# Altium schematic sheet TMS320F28335.SchDoc: TMS320F28335
size A4; Author: Anderson, Jorge Luis; CompanyName: LEICI - FI-UNLP; Revision: 1.3; SheetNumber: 2; SheetTotal: 5; Number: 1; ProjectName: Placa adaptadora TMS320F28835
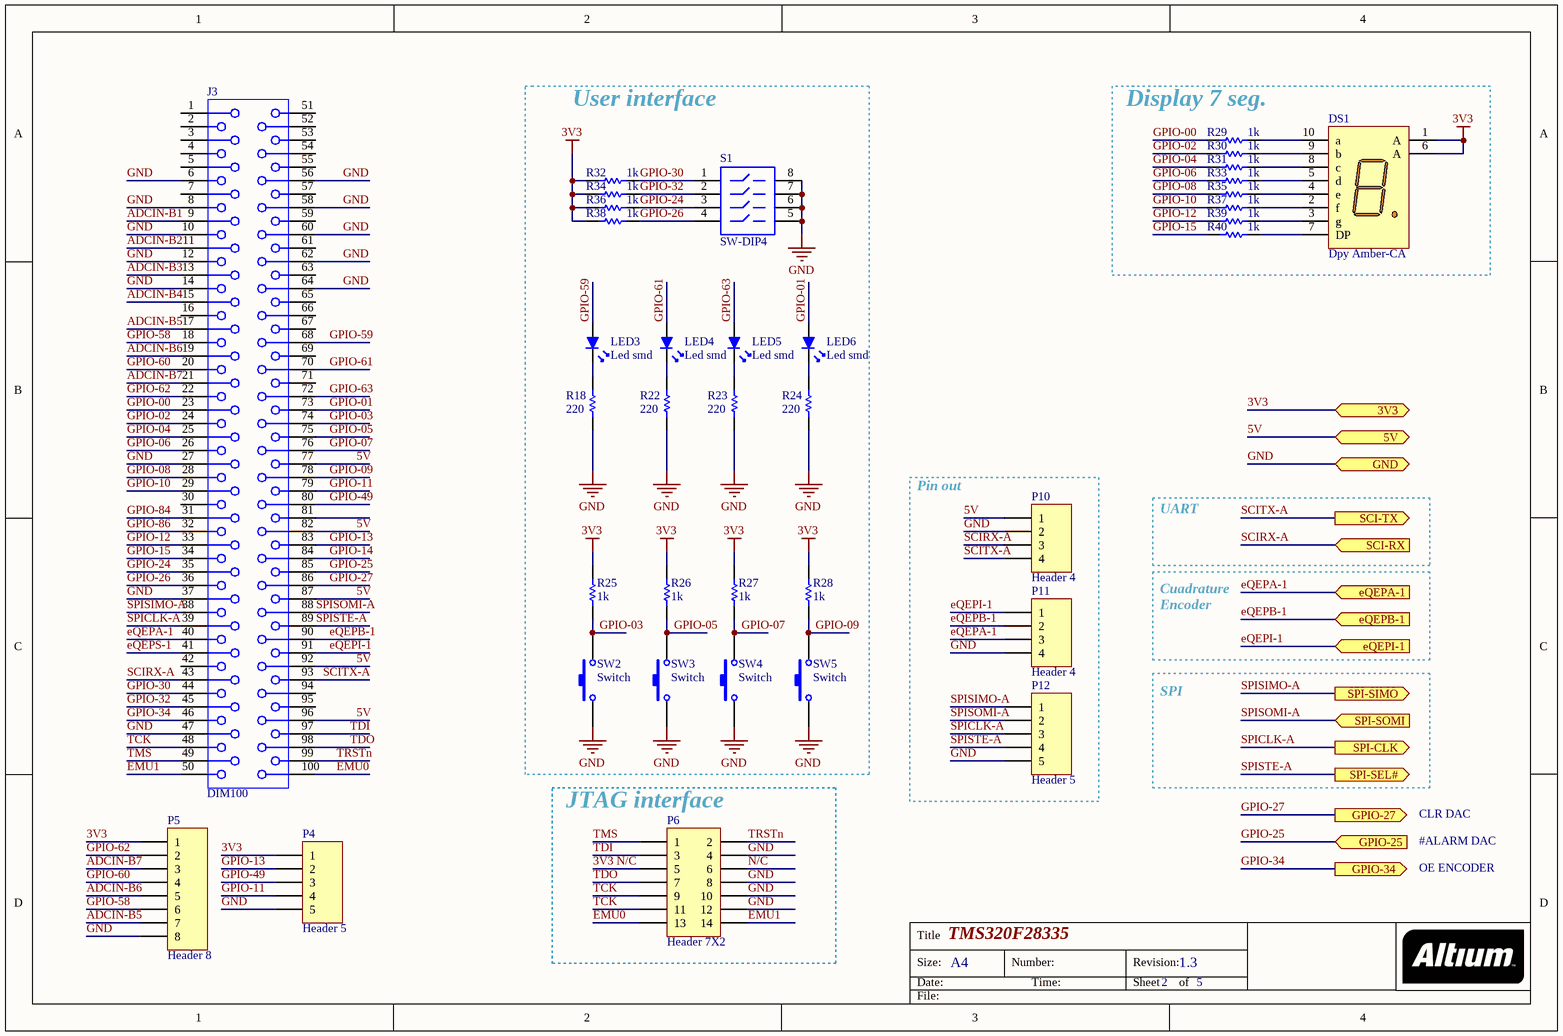
[diagram p0: TMS320F28335.SchDoc]

## Parts
DS1  Dpy Amber-CA  [A]
J3  DIM100  [390213-1]
LED3  Led smd  [LED 1206]
LED4  Led smd  [LED 1206]
LED5  Led smd  [LED 1206]
LED6  Led smd  [LED 1206]
P4  Header 5  [HDR1X5]
P5  Header 8  [HDR1X8]
P6  Header 7X2  [HDR2X7]
P10  Header 4  [HDR1X4]
P11  Header 4  [HDR1X4]
P12  Header 5  [HDR1X5]
R18  value 220  [R 1206]  (hidden comment: R220)
R22  value 220  [R 1206]  (hidden comment: R220)
R23  value 220  [R 1206]  (hidden comment: R220)
R24  value 220  [R 1206]  (hidden comment: R220)
R25  value 1k  [R 1206]  (hidden comment: R1k)
R26  value 1k  [R 1206]  (hidden comment: R1k)
R27  value 1k  [R 1206]  (hidden comment: R1k)
R28  value 1k  [R 1206]  (hidden comment: R1k)
R29  value 1k  [R 1206]  (hidden comment: R1k)
R30  value 1k  [R 1206]  (hidden comment: R1k)
R31  value 1k  [R 1206]  (hidden comment: R1k)
R32  value 1k  [R 1206]  (hidden comment: R1k)
R33  value 1k  [R 1206]  (hidden comment: R1k)
R34  value 1k  [R 1206]  (hidden comment: R1k)
R35  value 1k  [R 1206]  (hidden comment: R1k)
R36  value 1k  [R 1206]  (hidden comment: R1k)
R37  value 1k  [R 1206]  (hidden comment: R1k)
R38  value 1k  [R 1206]  (hidden comment: R1k)
R39  value 1k  [R 1206]  (hidden comment: R1k)
R40  value 1k  [R 1206]  (hidden comment: R1k)
S1  SW-DIP4  [DIP-8]
SW2  Switch  [TACT SW]
SW3  Switch  [TACT SW]
SW4  Switch  [TACT SW]
SW5  Switch  [TACT SW]

## Blocks framed on the sheet
User interface: LED3-LED6 R18 R22-R28 R32 R34 R36 R38 S1 SW2-SW5
Display 7 seg.: DS1 R29-R31 R33 R35 R37 R39 R40
Pin out: P10-P12
JTAG interface: P6

## Ports
3V3, 5V, eQEPA-1 (in), eQEPB-1 (in), eQEPI-1 (in), GND, GPIO-25 (in), GPIO-27 (out), GPIO-34 (out), SCI-RX (in), SCI-TX (out), SPI-CLK (out), SPI-SEL# (out), SPI-SIMO (out), SPI-SOMI (in)

## Nets
3V3: DS1.1(A) DS1.6(A) P4.1 P5.1 R25.2 R26.2 R27.2 R28.2 R32.1 R34.1 R36.1 R38.1 ; port 3V3
GND: J3.6(p6) J3.8(p8) J3.10(p10) J3.12(p12) J3.14(p14) J3.27(p27) J3.37(p37) J3.47(p47) J3.56(p56) J3.58(p58) J3.60(p60) J3.62(p62) J3.64(p64) P4.5 P5.8 P6.4 P6.8 P6.10 P6.12 P10.2 P11.4 P12.5 R18.2 R22.2 R23.2 R24.2 S1.5 S1.6 S1.7 S1.8 SW2.1 SW3.1 SW4.1 SW5.1 ; port GND
3V3 N/C: P6.5
5V: J3.77(p77) J3.82(p82) J3.87(p87) J3.92(p92) J3.96(p96) P10.1 ; port 5V
ADCIN-B1: J3.9(p9)
ADCIN-B2: J3.11(p11)
ADCIN-B3: J3.13(p13)
ADCIN-B4: J3.15(p15)
ADCIN-B5: J3.17(p17) P5.7
ADCIN-B6: J3.19(p19) P5.5
ADCIN-B7: J3.21(p21) P5.3
EMU0: J3.100(p100) P6.13
EMU1: J3.50(p50) P6.14
eQEPA-1: J3.40(p40) P11.3 ; port eQEPA-1
eQEPB-1: J3.90(p90) P11.2 ; port eQEPB-1
eQEPI-1: J3.91(p91) P11.1 ; port eQEPI-1
eQEPS-1: J3.41(p41)
GPIO-00: J3.23(p23) R29.1
GPIO-01: J3.73(p73) LED6.1(A)
GPIO-02: J3.24(p24) R30.1
GPIO-03: J3.74(p74) R25.1 SW2.2
GPIO-04: J3.25(p25) R31.1
GPIO-05: J3.75(p75) R26.1 SW3.2
GPIO-06: J3.26(p26) R33.1
GPIO-07: J3.76(p76) R27.1 SW4.2
GPIO-08: J3.28(p28) R35.1
GPIO-09: J3.78(p78) R28.1 SW5.2
GPIO-10: J3.29(p29) R37.1
GPIO-11: J3.79(p79) P4.4
GPIO-12: J3.33(p33) R39.1
GPIO-13: J3.83(p83) P4.2
GPIO-14: J3.84(p84)
GPIO-15: J3.34(p34) R40.1
GPIO-24: J3.35(p35) R36.2 S1.3
GPIO-25: J3.85(p85) ; port GPIO-25
GPIO-26: J3.36(p36) R38.2 S1.4
GPIO-27: J3.86(p86) ; port GPIO-27
GPIO-30: J3.44(p44) R32.2 S1.1
GPIO-32: J3.45(p45) R34.2 S1.2
GPIO-34: J3.46(p46) ; port GPIO-34
GPIO-49: J3.80(p80) P4.3
GPIO-58: J3.18(p18) P5.6
GPIO-59: J3.68(p68) LED3.1(A)
GPIO-60: J3.20(p20) P5.4
GPIO-61: J3.70(p70) LED4.1(A)
GPIO-62: J3.22(p22) P5.2
GPIO-63: J3.72(p72) LED5.1(A)
GPIO-84: J3.31(p31)
GPIO-86: J3.32(p32)
N/C: P6.6
SCIRX-A: J3.43(p43) P10.3 ; port SCI-RX
SCITX-A: J3.93(p93) P10.4 ; port SCI-TX
SPICLK-A: J3.39(p39) P12.3 ; port SPI-CLK
SPISIMO-A: J3.38(p38) P12.1 ; port SPI-SIMO
SPISOMI-A: J3.88(p88) P12.2 ; port SPI-SOMI
SPISTE-A: J3.89(p89) P12.4 ; port SPI-SEL#
TCK: J3.48(p48) P6.9 P6.11
TDI: J3.97(p97) P6.3
TDO: J3.98(p98) P6.7
TMS: J3.49(p49) P6.1
TRSTn: J3.99(p99) P6.2
NetDS1_2: DS1.2(f) R37.2
NetDS1_3: DS1.3(g) R39.2
NetDS1_4: DS1.4(e) R35.2
NetDS1_5: DS1.5(d) R33.2
NetDS1_7: DS1.7(DP) R40.2
NetDS1_8: DS1.8(c) R31.2
NetDS1_9: DS1.9(b) R30.2
NetDS1_10: DS1.10(a) R29.2
NetLED3_2: LED3.2(K) R18.1
NetLED4_2: LED4.2(K) R22.1
NetLED5_2: LED5.2(K) R23.1
NetLED6_2: LED6.2(K) R24.1

Not connected (* = marked no-connect by the designer): J3 1(p1) 2(p2) 3(p3) 4(p4) 5(p5) 7(p7) 16(p16) 30(p30) 42(p42) 51(p51) 52(p52) 53(p53) 54(p54) 55(p55) 57(p57) 59(p59) 61(p61) 63(p63) 65(p65) 66(p66) 67(p67) 69(p69) 71(p71) 81(p81) 94(p94) 95(p95)

## Notes on the sheet
- UART
- Cuadrature Encoder
- SPI
- #ALARM DAC
- CLR DAC
- OE ENCODER
- Title
- Size:
- Date:
- A4
- Number:
- Time:
- Revision:
- Sheet
- of
- File:

## Library data of the parts
DS1 = Dpy Amber-CA: 7.62 mm Black Surface Orange 7-Segment Display: CA, RH DP; MinimumIntensity: 354 ucd; Note: IF = 5 mA; Note: Pins 1 and 6 are redundant Anodes.; Published: 8-Jun-2000; LatestRevisionDate: 17-Dec-2003; LatestRevisionNote: Schematic revised, PCB Footprint replaced.; DatasheetVersion: 19-Feb-2002; PackageVersion: 11-Feb-2002; PackageReference: A; Publisher: Altium Limited; PackageDescription: LED, 7-Segment Display, 7.62 mm, RHD; 10 Leads; Row Space 5.08 mm; Pitch 2.54 mm; Colour: Orange; ComponentLink1Description: Manufacturer Link; ComponentLink1URL: http://www.agilent.com/
J3 = 390213-1: Vertical, DIMM 2P Low Insertion Force, 100 Position; Positions: 100; Rows: Dual; InsertionStyle: Direct Insert; EjectorLocation: Both Ends; PCB_Layout: Complies with manufacturer's recommendation.; DrillSize: Corresponds to nominal value.; Published: 15-Jun-2001; LatestRevisionDate: 17-Jul-2002; LatestRevisionNote: Re-released for DXP Platform.; DatasheetDocument: 21-Apr-1999; PackageDocument: 21-Apr-1999; PackageReference: 390213-1; Publisher: Altium Limited; Orientation: Vertical; ComponentLink1Description: Manufacturer Link; ComponentLink1URL: http://www.tycoelectronics.com/; ComponentLink2Description: Packaging Specification; ComponentLink2URL: http://ecommas.tycoelectronics.com/commerce/DocumentDelivery/DDEController?Action=showdoc&DocId=Customer+Drawing%7F390213%7FG%7Ftif%7FEnglish%7FENG_CD_390213_G.tif
LED3 LED5 = LED: Led green; .Creator: SR; .PCBCheck: Used; .SCHCheck: Used
LED4 LED6 = LED: Led yellow; .Creator: SR; .PCBCheck: Used; .SCHCheck: Used
P4 P12 = Header 5: Header, 5-Pin; LatestRevisionDate: 17-Jul-2002; LatestRevisionNote: Re-released for DXP Platform.; Publisher: Altium Limited
P5 = Header 8: Header, 8-Pin; LatestRevisionDate: 17-Jul-2002; LatestRevisionNote: Re-released for DXP Platform.; Publisher: Altium Limited
P6 = Header 7X2: Header, 7-Pin, Dual row; LatestRevisionDate: 17-Jul-2002; LatestRevisionNote: Re-released for DXP Platform.; Publisher: Altium Limited
P10 P11 = Header 4: Header, 4-Pin; LatestRevisionDate: 17-Jul-2002; LatestRevisionNote: Re-released for DXP Platform.; Publisher: Altium Limited
R18 R22-R40 = R: Resistencia; .Creator: SR; .PCBCheck: Used; .SCHCheck: Used; Category: Resistencias
S1 = SW-DIP4: DIP Switch; Published: 24-Mar-1999; LatestRevisionDate: 17-Jul-2002; LatestRevisionNote: Re-released for DXP Platform.; PackageReference: DIP-8; Publisher: Altium Limited
SW2-SW5 = Pulsador NA 4 term: .Creator: G; .PCBCheck: G; .SCHCheck: G